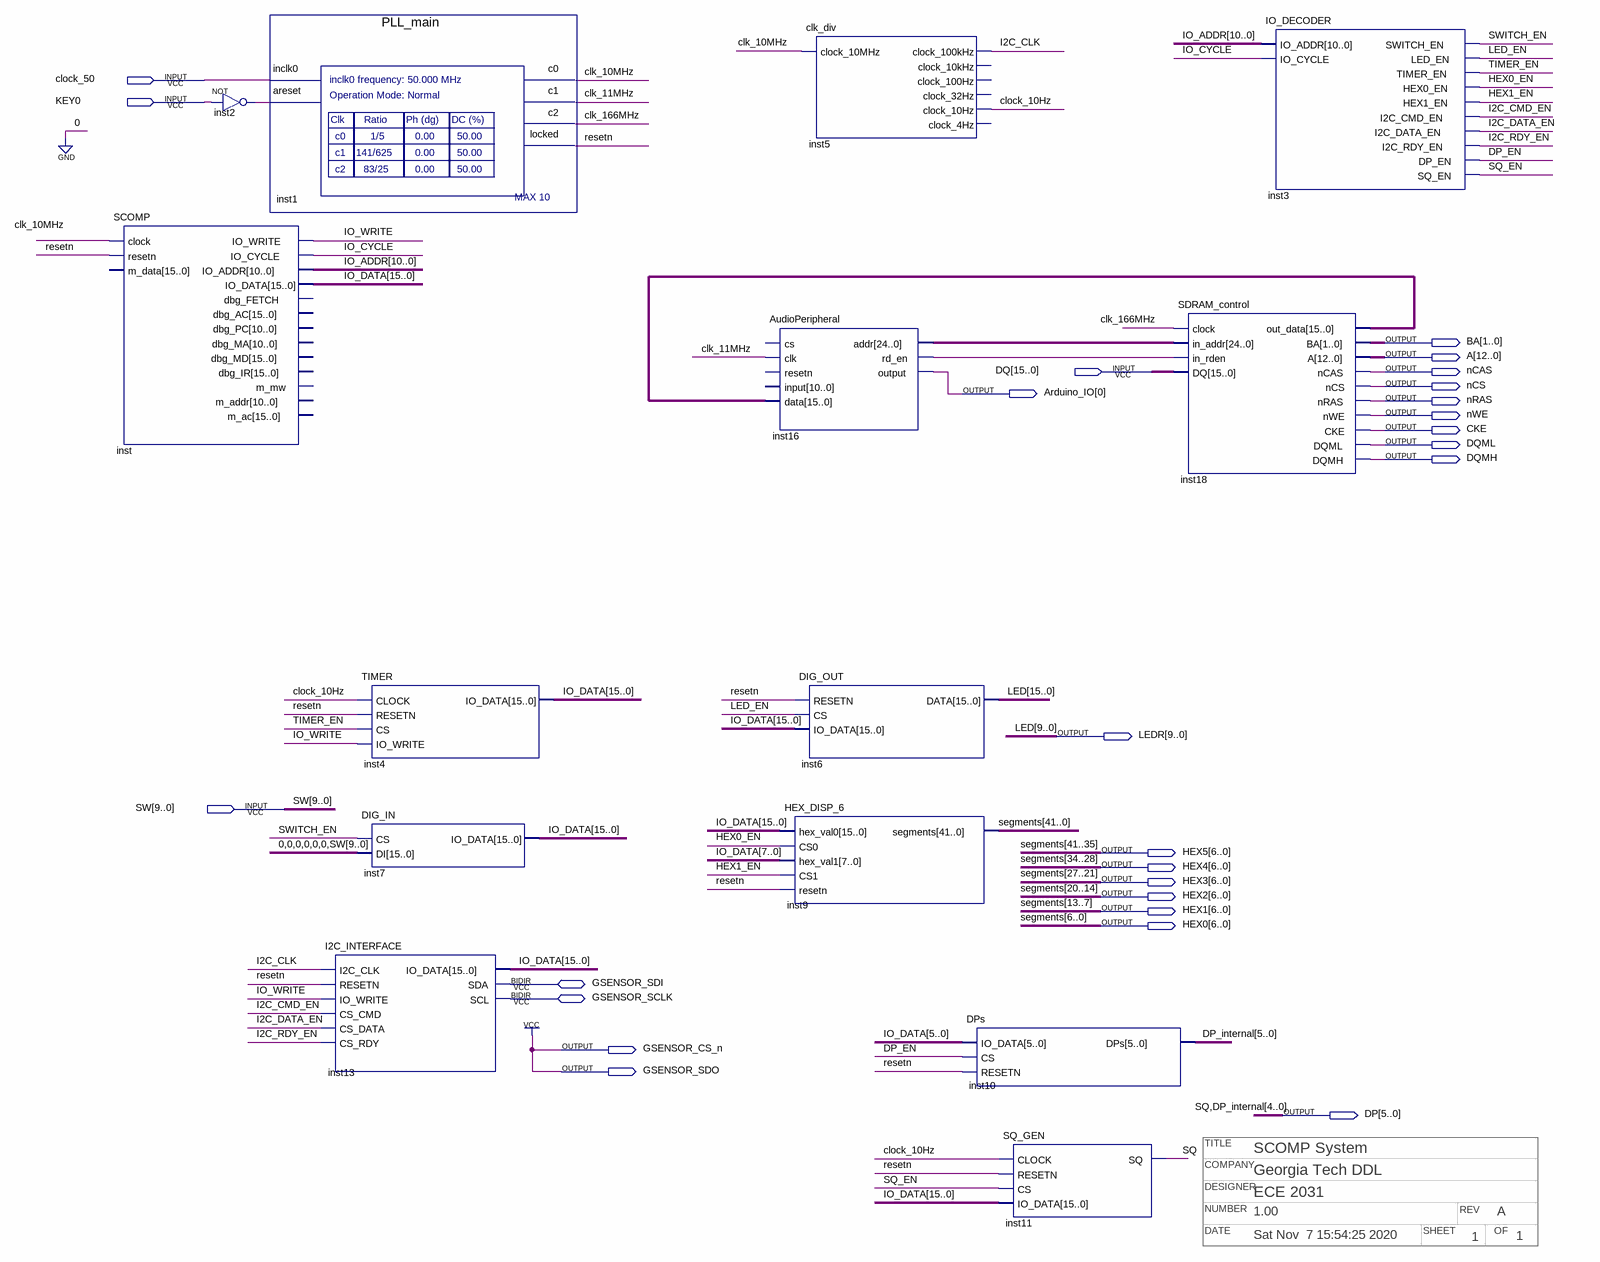
[diagram p0: schematic sheet]
// Quartus schematic SCOMP_System.bdf as structural Verilog: 14 symbols, 26 pins
// Title block: COMPANY: Georgia Tech DDL; DATE: Sat Nov  7 15:54:25 2020; DESIGNER: ECE 2031; NUMBER: 1.00; OF: 1; REV: A; SHEET: 1; TITLE: SCOMP System
module SCOMP_System (
  input  clock_50,
  input  KEY0,
  input  [15:0] DQ,
  input  [9:0] SW,
  inout  GSENSOR_SDI,
  inout  GSENSOR_SCLK,
  output [1:0] BA,
  output [12:0] A,
  output nCAS,
  output nCS,
  output [0:0] Arduino_IO,
  output nRAS,
  output nWE,
  output CKE,
  output DQML,
  output DQMH,
  output [9:0] LEDR,
  output [6:0] HEX5,
  output [6:0] HEX4,
  output [6:0] HEX3,
  output [6:0] HEX2,
  output [6:0] HEX1,
  output [6:0] HEX0,
  output GSENSOR_CS_n,
  output GSENSOR_SDO,
  output [5:0] DP
);

  wire clk_10MHz, clk_11MHz, clk_166MHz, clock_10Hz, DP_EN, HEX0_EN, HEX1_EN, I2C_CLK, I2C_CMD_EN,
       I2C_DATA_EN, I2C_RDY_EN, inst2_out, inst16_rd_en, IO_CYCLE, IO_WRITE, LED_EN, resetn, SQ_EN,
       SWITCH_EN, TIMER_EN;
  wire [5:5] DP_internal;
  wire [10:0] IO_ADDR;
  wire [15:0] inst18_out_data, IO_DATA;
  wire [15:10] LED;
  wire [24:0] inst16_addr;

  SCOMP inst (
    .clock(clk_10MHz), .resetn(resetn), .IO_WRITE(IO_WRITE), .IO_CYCLE(IO_CYCLE), .IO_ADDR(IO_ADDR),
    .IO_DATA(IO_DATA));  // open: m_data, dbg_FETCH, dbg_AC, dbg_PC, dbg_MA, dbg_MD, dbg_IR, m_mw, m_addr, m_ac
  not inst2 (inst2_out, KEY0);
  PLL_main inst1 (
    .inclk0(clock_50), .areset(inst2_out), .c0(clk_10MHz), .c1(clk_11MHz), .c2(clk_166MHz), .locked(resetn));
  TIMER inst4 (.CLOCK(clock_10Hz), .RESETN(resetn), .CS(TIMER_EN), .IO_WRITE(IO_WRITE), .IO_DATA(IO_DATA));
  DIG_IN inst7 (.CS(SWITCH_EN), .DI({{6{1'b0}}, SW}), .IO_DATA(IO_DATA));
  I2C_INTERFACE inst13 (
    .I2C_CLK(I2C_CLK), .RESETN(resetn), .IO_WRITE(IO_WRITE), .CS_CMD(I2C_CMD_EN), .CS_DATA(I2C_DATA_EN),
    .CS_RDY(I2C_RDY_EN), .IO_DATA(IO_DATA), .SDA(GSENSOR_SDI), .SCL(GSENSOR_SCLK));
  AudioPeripheral inst16 (
    .clk(clk_11MHz), .data(inst18_out_data), .addr(inst16_addr), .rd_en(inst16_rd_en),
    .\output (Arduino_IO[0]));  // open: cs, resetn, input
  clk_div inst5 (
    .clock_10MHz(clk_10MHz), .clock_100kHz(I2C_CLK), .clock_10Hz(clock_10Hz));  // open: clock_10kHz, clock_100Hz, clock_32Hz, clock_4Hz
  DIG_OUT inst6 (.RESETN(resetn), .CS(LED_EN), .IO_DATA(IO_DATA), .DATA({LED, LEDR}));
  HEX_DISP_6 inst9 (
    .hex_val0(IO_DATA), .CS0(HEX0_EN), .hex_val1(IO_DATA[7:0]), .CS1(HEX1_EN), .resetn(resetn),
    .segments({HEX5, HEX4, HEX3, HEX2, HEX1, HEX0}));
  DPs inst10 (.IO_DATA(IO_DATA[5:0]), .CS(DP_EN), .RESETN(resetn), .DPs({DP_internal[5], DP[4:0]}));
  SQ_GEN inst11 (.CLOCK(clock_10Hz), .RESETN(resetn), .CS(SQ_EN), .IO_DATA(IO_DATA), .SQ(DP[5]));
  SDRAM_control inst18 (
    .clock(clk_166MHz), .in_addr(inst16_addr), .in_rden(inst16_rd_en), .DQ(DQ), .out_data(inst18_out_data),
    .BA(BA), .A(A), .nCAS(nCAS), .nCS(nCS), .nRAS(nRAS), .nWE(nWE), .CKE(CKE), .DQML(DQML), .DQMH(DQMH));
  IO_DECODER inst3 (
    .IO_ADDR(IO_ADDR), .IO_CYCLE(IO_CYCLE), .SWITCH_EN(SWITCH_EN), .LED_EN(LED_EN), .TIMER_EN(TIMER_EN),
    .HEX0_EN(HEX0_EN), .HEX1_EN(HEX1_EN), .I2C_CMD_EN(I2C_CMD_EN), .I2C_DATA_EN(I2C_DATA_EN),
    .I2C_RDY_EN(I2C_RDY_EN), .DP_EN(DP_EN), .SQ_EN(SQ_EN));

  assign GSENSOR_CS_n = 1'b1;
  assign GSENSOR_SDO = 1'b1;

  // Other names for the same wires on the sheet: DP_internal[4:0] = DP[4:0]; LED[9:0] = LEDR;
  //   segments[41:0] = {HEX5, HEX4, HEX3, HEX2, HEX1, HEX0}; SQ = DP[5]
endmodule
